# EAGLE schematic Processor (EAGLE 7.2.0)
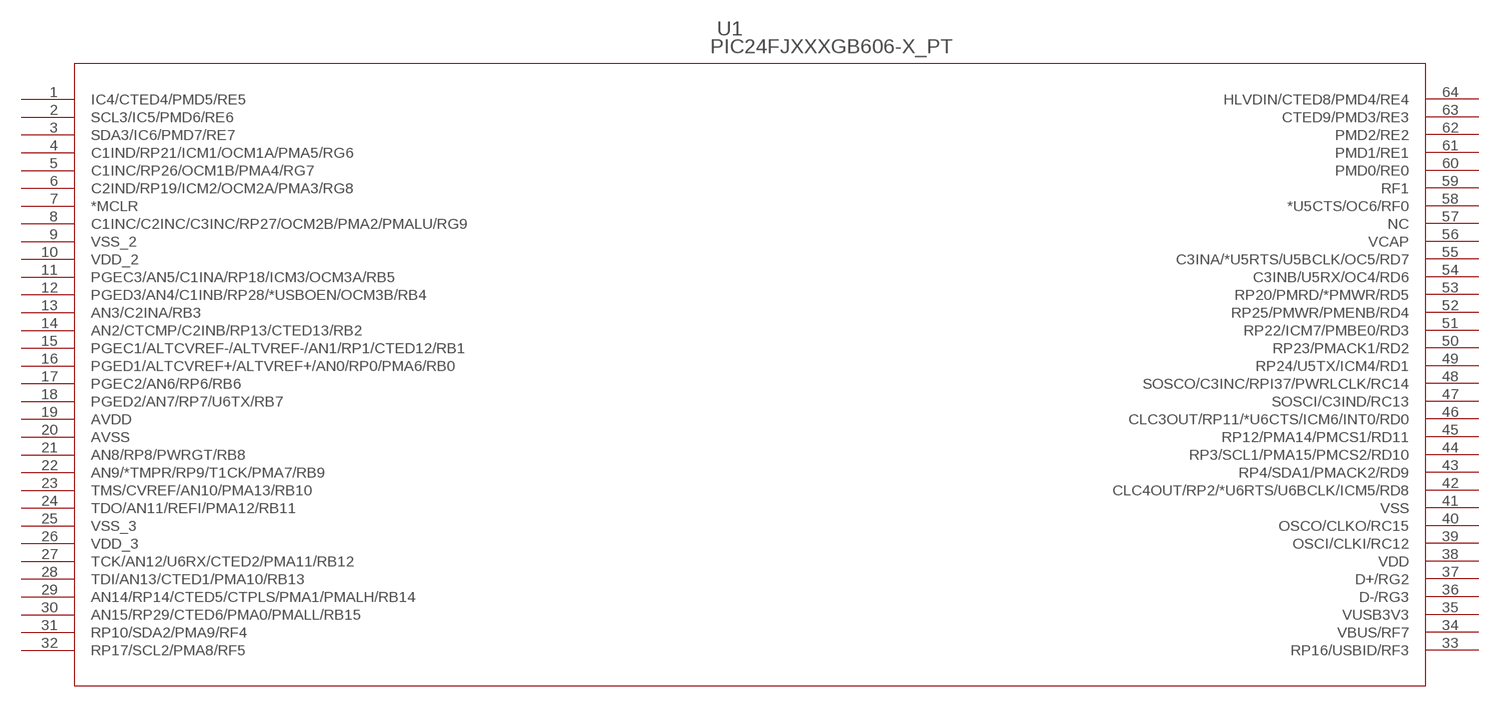
[diagram p0: schematic, sheet 1]

## Parts
U1  PIC24FJXXXGB606-X_PT  [TQFP64_10X10MC]
Unconnected: U1.1(IC4/CTED4/PMD5/RE5) U1.2(SCL3/IC5/PMD6/RE6) U1.3(SDA3/IC6/PMD7/RE7) U1.4(C1IND/RP21/ICM1/OCM1A/PMA5/RG6) U1.5(C1INC/RP26/OCM1B/PMA4/RG7) U1.6(C2IND/RP19/ICM2/OCM2A/PMA3/RG8) U1.7(*MCLR) U1.8(C1INC/C2INC/C3INC/RP27/OCM2B/PMA2/PMALU/RG9) U1.11(PGEC3/AN5/C1INA/RP18/ICM3/OCM3A/RB5) U1.12(PGED3/AN4/C1INB/RP28/*USBOEN/OCM3B/RB4) U1.13(AN3/C2INA/RB3) U1.14(AN2/CTCMP/C2INB/RP13/CTED13/RB2) U1.15(PGEC1/ALTCVREF-/ALTVREF-/AN1/RP1/CTED12/RB1) U1.16(PGED1/ALTCVREF+/ALTVREF+/AN0/RP0/PMA6/RB0) U1.17(PGEC2/AN6/RP6/RB6) U1.18(PGED2/AN7/RP7/U6TX/RB7) U1.21(AN8/RP8/PWRGT/RB8) U1.22(AN9/*TMPR/RP9/T1CK/PMA7/RB9) U1.23(TMS/CVREF/AN10/PMA13/RB10) U1.24(TDO/AN11/REFI/PMA12/RB11) U1.27(TCK/AN12/U6RX/CTED2/PMA11/RB12) U1.28(TDI/AN13/CTED1/PMA10/RB13) U1.29(AN14/RP14/CTED5/CTPLS/PMA1/PMALH/RB14) U1.30(AN15/RP29/CTED6/PMA0/PMALL/RB15) U1.31(RP10/SDA2/PMA9/RF4) U1.32(RP17/SCL2/PMA8/RF5) U1.33(RP16/USBID/RF3) U1.34(VBUS/RF7) U1.36(D-/RG3) U1.37(D+/RG2) U1.39(OSCI/CLKI/RC12) U1.40(OSCO/CLKO/RC15) U1.42(CLC4OUT/RP2/*U6RTS/U6BCLK/ICM5/RD8) U1.43(RP4/SDA1/PMACK2/RD9) U1.44(RP3/SCL1/PMA15/PMCS2/RD10) U1.45(RP12/PMA14/PMCS1/RD11) U1.46(CLC3OUT/RP11/*U6CTS/ICM6/INT0/RD0) U1.47(SOSCI/C3IND/RC13) U1.48(SOSCO/C3INC/RPI37/PWRLCLK/RC14) U1.49(RP24/U5TX/ICM4/RD1) U1.50(RP23/PMACK1/RD2) U1.51(RP22/ICM7/PMBE0/RD3) U1.52(RP25/PMWR/PMENB/RD4) U1.53(RP20/PMRD/*PMWR/RD5) U1.54(C3INB/U5RX/OC4/RD6) U1.55(C3INA/*U5RTS/U5BCLK/OC5/RD7) U1.57(NC) U1.58(*U5CTS/OC6/RF0) U1.59(RF1) U1.60(PMD0/RE0) U1.61(PMD1/RE1) U1.62(PMD2/RE2) U1.63(CTED9/PMD3/RE3) U1.64(HLVDIN/CTED8/PMD4/RE4)

## Power pins joined to a net without a drawn wire
AVDD: U1.19(AVDD)
AVSS: U1.20(AVSS)
VCAP: U1.56(VCAP)
VDD: U1.38(VDD)
VDD_2: U1.10(VDD_2)
VDD_3: U1.26(VDD_3)
VSS: U1.41(VSS)
VSS_2: U1.9(VSS_2)
VSS_3: U1.25(VSS_3)
VUSB3V3: U1.35(VUSB3V3)

## Library data of the parts
U1 = 24FJ1024GB606PT-E:PIC24FJXXXGB606-X_PT; MANUFACTURER_PART_NUMBER: pic24fjxxxgb606-x_pt; VENDOR: Microchip